# EAGLE design connector (EAGLE 6.5.0)
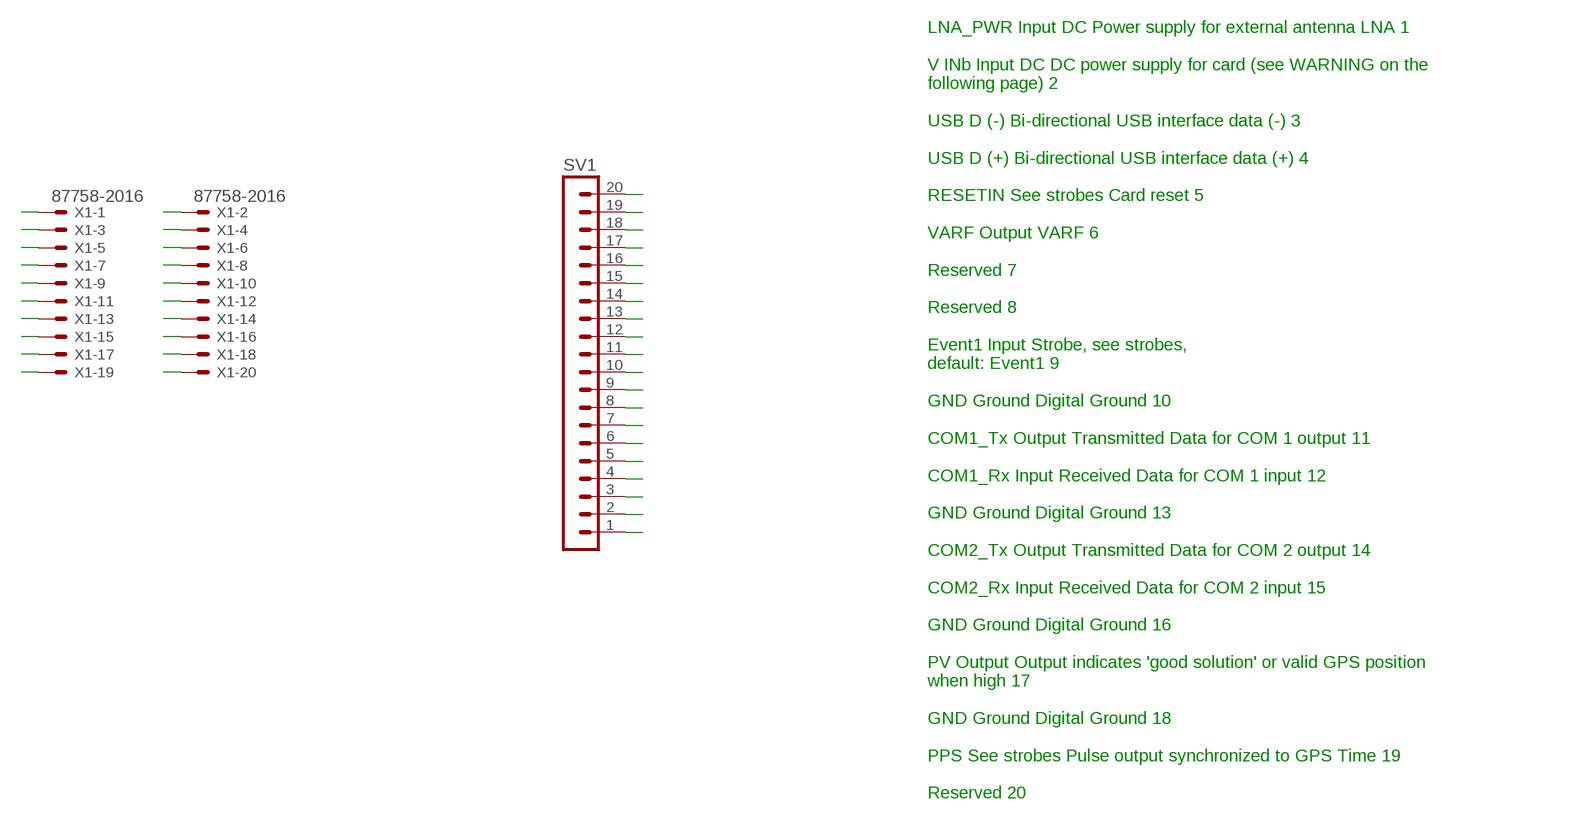
[diagram p0: schematic, sheet 1]

## Parts
SV1  MA20-1L  [MA20-1L]
X1  87758-2016  [87758-2016]

## Nets
COM1_RX: SV1.12 X1.12
COM1_TX: SV1.11 X1.11
COM2_RX: SV1.15 X1.15
COM2_TX: SV1.14 X1.14
EVENT1: SV1.9 X1.9
GND: SV1.10 SV1.13 SV1.16 SV1.18 X1.10 X1.13 X1.16 X1.18
LNA_PWR: SV1.1 X1.1
N$1: SV1.20
N$3: X1.7
N$13: X1.8
N$15: SV1.8
N$16: SV1.7
N$19: X1.20
PPS: SV1.19 X1.19
PV: SV1.17 X1.17
RESETIN: SV1.5 X1.5
USBD+: SV1.4 X1.4
USBD-: SV1.3 X1.3
VARF: SV1.6 X1.6
VINB: SV1.2 X1.2

## Notes on the sheet
- LNA_PWR Input DC Power supply for external antenna LNA 1
  
  V INb Input DC DC power supply for card (see WARNING on the
  following page) 2
  
  USB D (-) Bi-directional USB interface data (-) 3
  
  USB D (+) Bi-directional USB interface data (+) 4
  
  RESETIN See strobes Card reset 5
  
  VARF Output VARF 6
  
  Reserved 7
  
  Reserved 8
  
  Event1 Input Strobe, see strobes,
  default: Event1 9
  
  GND Ground Digital Ground 10
  
  COM1_Tx Output Transmitted Data for COM 1 output 11
  
  COM1_Rx Input Received Data for COM 1 input 12
  
  GND Ground Digital Ground 13
  
  COM2_Tx Output Transmitted Data for COM 2 output 14
  
  COM2_Rx Input Received Data for COM 2 input 15
  
  GND Ground Digital Ground 16
  
  PV Output Output indicates 'good solution' or valid GPS position
  when high 17
  
  GND Ground Digital Ground 18
  
  PPS See strobes Pulse output synchronized to GPS Time 19
  
  Reserved 20

## Library data of the parts
SV1 = con-lstb:MA20-1L: PIN HEADER; OC_FARNELL: unknown; OC_NEWARK: unknown
X1 = con-molex:87758-2016: 20 Pin - 2mm Dual Row Single Wafer, Vertical T/H HDR Source: http://www.molex.com/pdm_docs/sd/877580616_sd.pdf; MPN: 87758-2016; OC_FARNELL: 7472374; OC_NEWARK: 25M5677

## Board
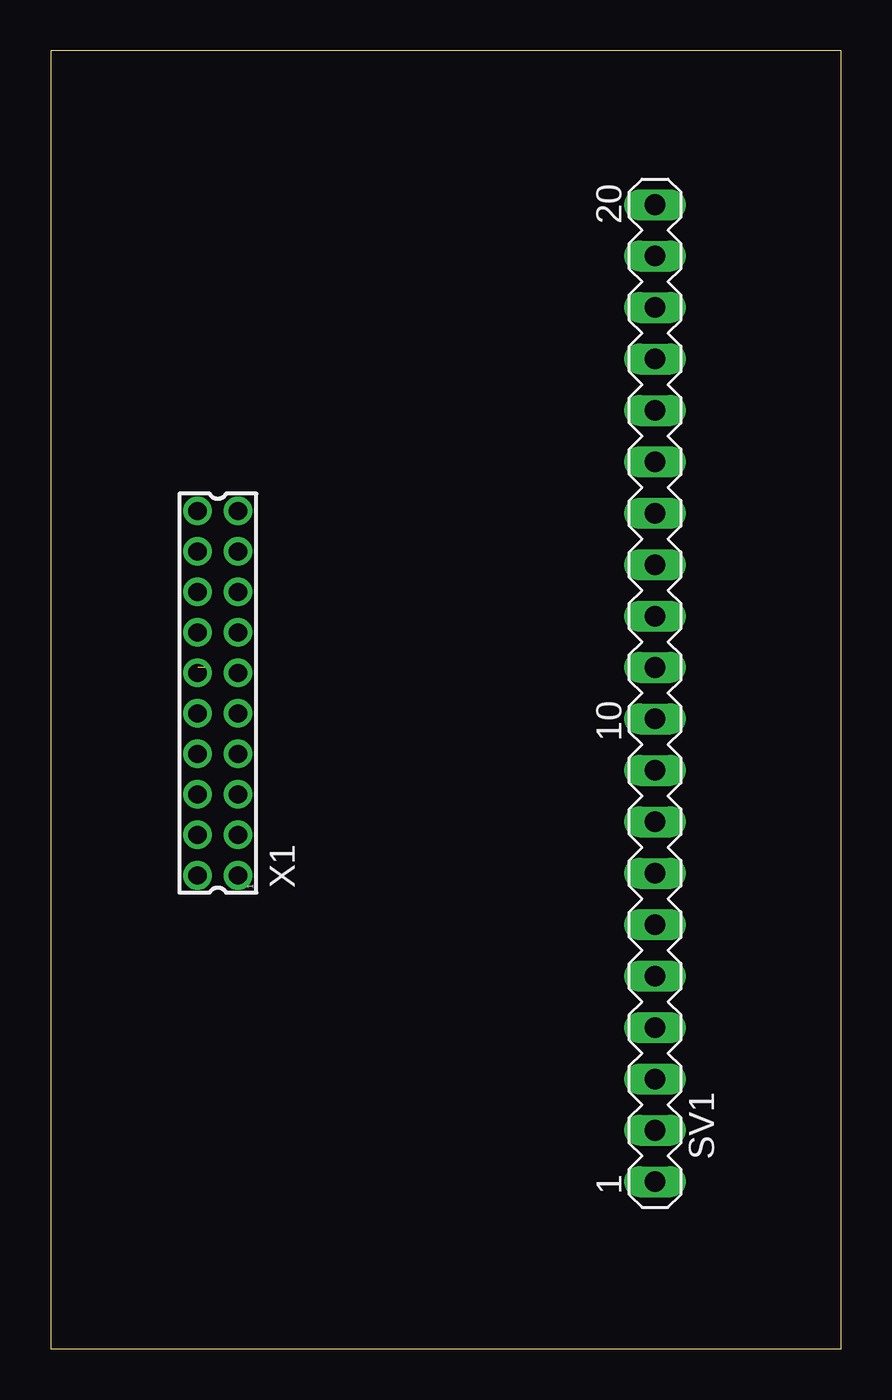
[diagram p1: board, top side]
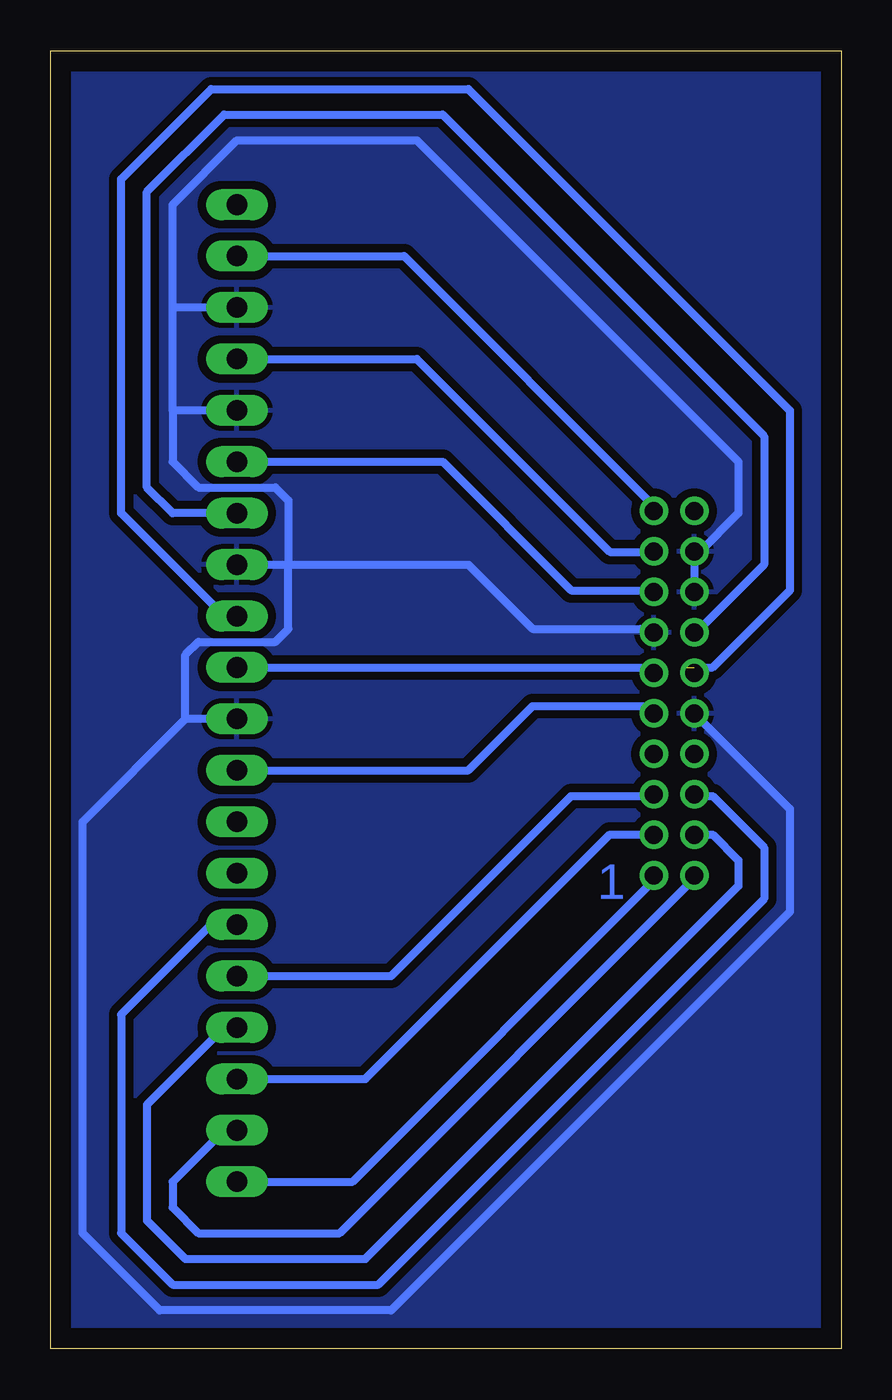
[diagram p2: board, bottom side, seen from below]

Size 39.04 x 64.12 mm. Coordinates in mm from the lower left corner, seen from the top.
Outline: 0,0 39.04,0 39.04,64.12 0,64.12 0,0
Copper layers (1*16): Top 0.035mm / dielectric 1.5mm / Bottom 0.035mm
Design rules "default": minimum track width 10mil, minimum drill 24mil, track to track 8mil, track to pad 8mil, pad to pad 8mil, via to via 8mil, smd to smd 8mil, copper to edge 40mil, drill to drill 8mil, minimum pad ring 10mil, minimum via ring 8mil, stop-mask expansion 4mil, vias tented up to drill 0mil, thermal gap 10mil

### Footprints (pad centres in the part's own frame; a part is rotated, then mirrored left to right if it is on the bottom)
MA20-1L = drill 1.016 long: 1 24.13,0; 2 21.59,0; 3 19.05,0; 4 16.51,0; 5 13.97,0; 6 11.43,0; 7 8.89,0; 8 6.35,0; 9 3.81,0; 10 1.27,0; 11 -1.27,0; 12 -3.81,0; 13 -6.35,0; 14 -8.89,0; 15 -11.43,0; 16 -13.97,0; 17 -16.51,0; 18 -19.05,0; 19 -21.59,0; 20 -24.13,0
87758-2016 = drill 0.9 pad 1.27: 1 -9,-1; 2 -9,1; 3 -7,-1; 4 -7,1; 5 -5,-1; 6 -5,1; 7 -3,-1; 8 -3,1; 9 -1,-1; 10 -1,1; 11 1,-1; 12 1,1; 13 3,-1; 14 3,1; 15 5,-1; 16 5,1; 17 7,-1; 18 7,1; 19 9,-1; 20 9,1

### Placement (x,y rotation side)
SV1  29.84,32.38 270 top
X1  8.26,32.38 90 top

### Tracks (layer width: path | path; a pad name or v marks a point on that pad's centre or on a via)
COM1_RX  (1 unrouted)
  Bottom 0.406: 7.25,33.66 X1.12 | 7.62,33.66 6.35,33.66 2.54,37.46 2.54,46.35 18.41,62.23 31.12,62.23 35.56,57.79 35.56,41.27 30.48,36.2 SV1.12
COM1_TX
  Bottom 0.406: SV1.11 9.26,33.66 X1.11
COM2_RX
  Bottom 0.406: SV1.15 19.68,43.81 13.34,37.46 9.26,37.46 X1.15
COM2_TX
  Bottom 0.406: SV1.14 33.02,41.27 34.29,42.55 34.29,57.15 30.48,60.96 19.68,60.96 3.81,45.09 3.81,38.73 6.99,35.56 7.25,35.56 X1.14
EVENT1
  Bottom 0.406: SV1.9 18.41,28.57 15.24,31.75 9.26,31.75 X1.9
GND
  Bottom 0.406: SV1.13 27.3,38.73 | 27.3,38.73 18.41,38.73 15.24,35.56 9.89,35.56 X1.13 | 33.02,46.35 33.02,51.43 | 33.02,51.43 33.02,56.51 29.84,59.69 20.95,59.69 5.08,43.81 5.08,41.27 6.99,39.37 7.62,39.37 | X1.18 X1.16 | SV1.10 32.38,31.12 | 32.38,31.12 32.38,34.29 31.75,34.92 27.94,34.92 27.3,35.56 27.3,38.73 | SV1.16 33.02,46.35 | SV1.18 33.02,51.43 | 33.02,46.35 33.02,43.81 31.75,42.55 27.94,42.55 27.3,41.91 27.3,38.73 | 32.38,31.12 37.46,26.03 37.46,5.71 33.66,1.9 22.22,1.9 2.54,21.59 2.54,26.67 X1.10
  pour Bottom (isolate 0.406): -0.64,64.77 40,64.77 40,-1.27 -1.27,-1.27 -1.27,-0.64 -0.64,-0.64
LNA_PWR
  Bottom 0.406: SV1.1 24.13,8.25 9.26,23.13 X1.1
PPS
  Bottom 0.406: SV1.19 21.59,53.98 9.26,41.64 X1.19
PV
  Bottom 0.406: SV1.17 20.95,48.89 11.43,39.37 9.26,39.37 X1.17
RESETIN
  Bottom 0.406: SV1.5 22.22,18.41 13.34,27.3 9.26,27.3 X1.5
USBD+
  Bottom 0.406: X1.4 7.25,25.4 6.35,25.4 5.08,24.13 5.08,22.86 23.49,4.45 32.38,4.45 34.29,6.35 34.29,12.06 30.48,15.88 SV1.4
USBD-
  Bottom 0.406: SV1.3 23.49,13.34 11.43,25.4 9.26,25.4 X1.3
VARF
  Bottom 0.406: X1.6 7.25,27.3 6.35,27.3 3.81,24.77 3.81,22.23 22.86,3.18 33.02,3.18 35.56,5.71 35.56,16.51 31.12,20.95 SV1.6
VINB
  Bottom 0.406: SV1.2 30.48,10.79 33.02,8.25 33.02,6.98 31.75,5.71 24.77,5.71 7.25,23.23 X1.2

### Text on the board
Bottom: 1